# EAGLE schematic lt1236LS8_reference_module (EAGLE 7.4.0)
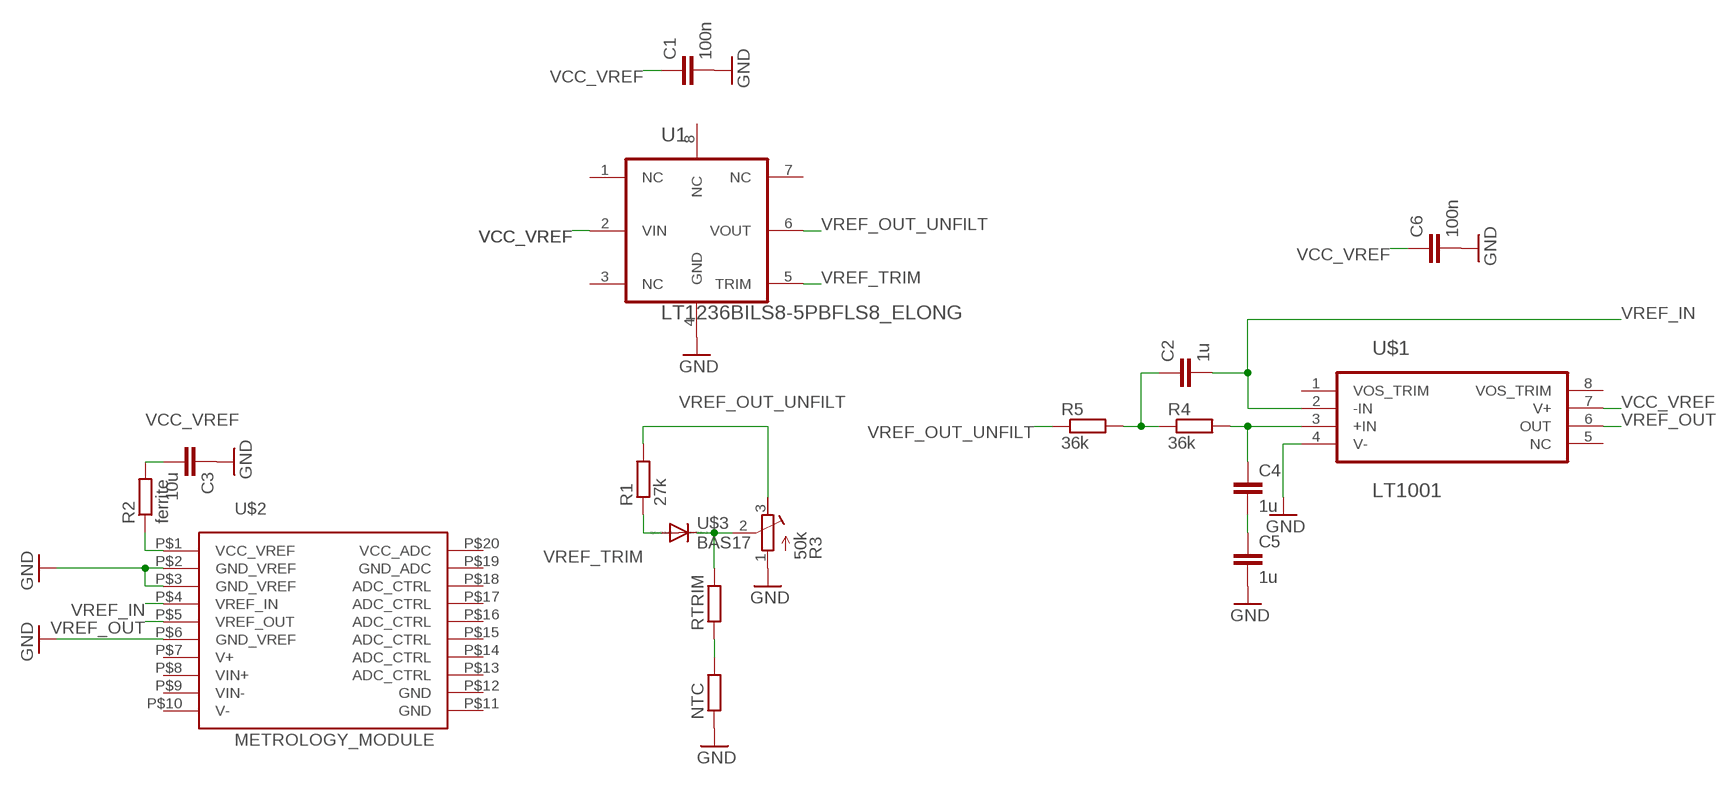
[diagram p0: schematic, sheet 1]

## Parts
C1  100n  C-EUC0603  [C0603]
C2  1u  C-EU025-060X050  [C025-060X050]
C3  10u  C-EUC0805  [C0805]
C4  1u  C-EU025-060X050  [C025-060X050]
C5  1u  C-EU025-060X050  [C025-060X050]
C6  100n  C-EUC0603  [C0603]
NTC  R-EU_R0805  [R0805]
R1  27k  R-EU_R0805  [R0805]
R2  ferrite  R-EU_R0805  [R0805]
R3  50k  R-TRIMM3224W  [RTRIM3224W]
R4  36k  R-EU_R0805  [R0805]
R5  36k  R-EU_R0805  [R0805]
RTRIM  R-EU_R0805  [R0805]
U1  LT1236BILS8-5PBFLS8_ELONG  [LS8_ELONG]
U$1  LT1001  [N8-PDIP8]
U$2  METROLOGY_MODULE  [METROLOGY_MODULE]
U$3  BAS17  [SOT23_HAND]

## Nets
GND: C1.2 C3.1 C5.2 C6.2 NTC.1 R3.1(E) U1.4(GND) U$1.4(V-) U$2.P$2(GND_VREF) U$2.P$3(GND_VREF) U$2.P$6(GND_VREF)
N$1: R2.1 U$2.P$1(VCC_VREF)
N$2: R3.2(S) RTRIM.2 U$3.3(C)
N$3: NTC.2 RTRIM.1
N$5: C2.1 R4.1 R5.2
N$6: C4.1 R4.2 U$1.3(+IN)
N$8: C4.2 C5.1
VCC_VREF: C1.1 C3.2 C6.1 R2.2 U1.2(VIN) U$1.7(V+)
VREF_IN: C2.2 U$1.2(-IN) U$2.P$4(VREF_IN)
VREF_OUT: U$1.6(OUT) U$2.P$5(VREF_OUT)
VREF_OUT_UNFILT: R1.2 R3.3(A) R5.1 U1.6(VOUT)
VREF_TRIM: R1.1 U1.5(TRIM) U$3.1(A)
Unconnected: U1.1(NC) U1.3(NC) U1.7(NC) U1.8(NC) U$1.1(VOS_TRIM) U$1.5(NC) U$1.8(VOS_TRIM) U$2.P$7(V+) U$2.P$8(VIN+) U$2.P$9(VIN-) U$2.P$10(V-) U$2.P$11(GND) U$2.P$12(GND) U$2.P$13(ADC_CTRL) U$2.P$14(ADC_CTRL) U$2.P$15(ADC_CTRL) U$2.P$16(ADC_CTRL) U$2.P$17(ADC_CTRL) U$2.P$18(ADC_CTRL) U$2.P$19(GND_ADC) U$2.P$20(VCC_ADC)

## Library data of the parts
C1-C6 = SquantorRCL:C-EU: CAPACITOR, European symbol
NTC R1 R2 R4 R5 RTRIM = SquantorRCL:R-EU_: RESISTOR, European symbol
R3 = SquantorRCL:R-TRIMM: Trimm resistor
U1 = SquantorLinearTechnology:LT1236BILS8-5PBF: V REF, 40VIN, 5V, 0.1%, 10PPM/C, 8LCC
U$1 = SquantorLinearTechnology:LT1001
U$2 = SquantorPCBOutline:METROLOGY_MODULE
U$3 = SquantorNxp:BAS17